# EAGLE design ch340-breakout (EAGLE 6.1)
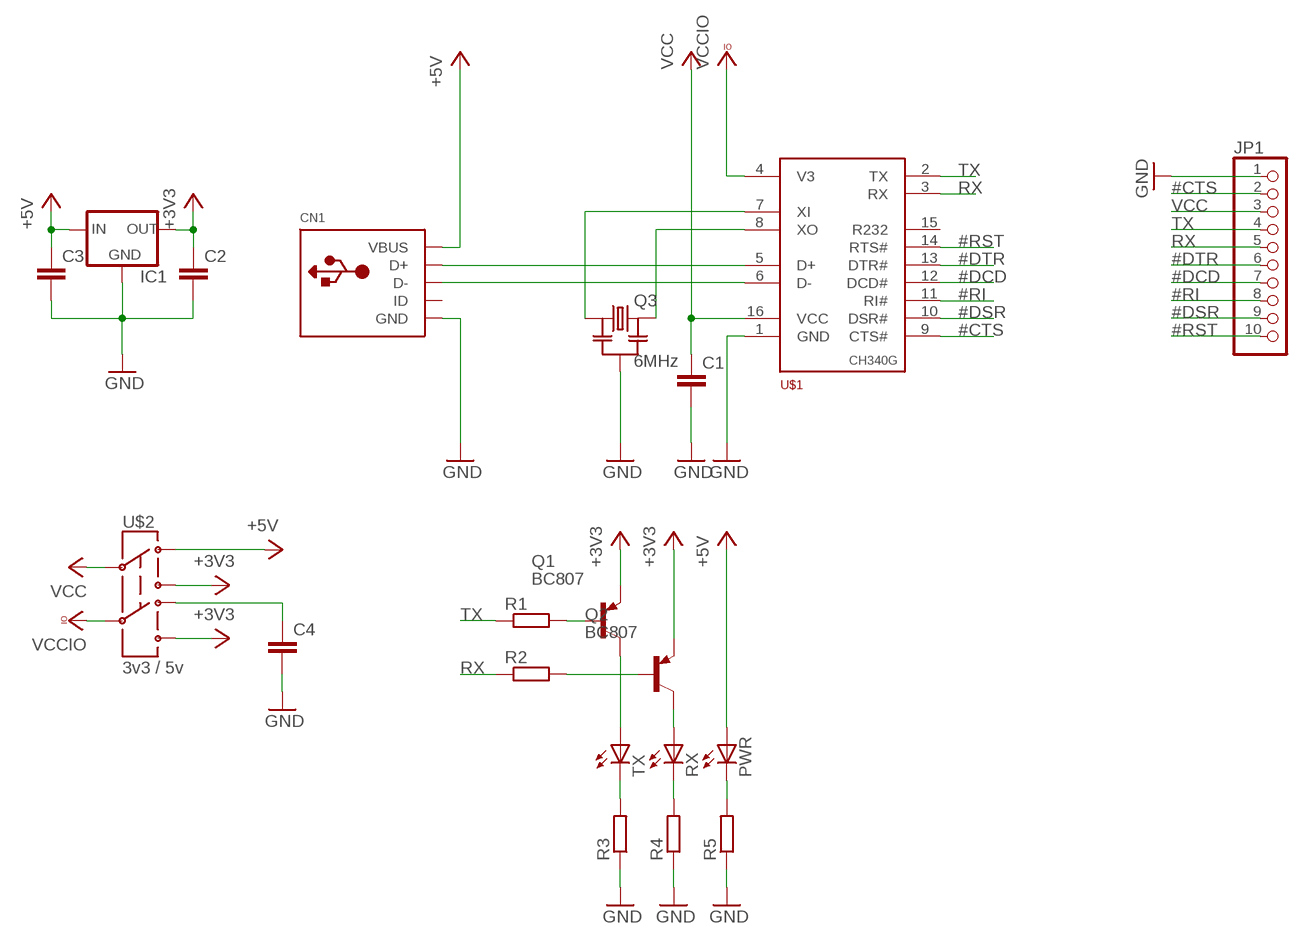
[diagram p0: schematic, sheet 1]

## Parts
C1  C-EUC0805  [C0805]
C2  C-EUC0805  [C0805]
C3  C-EUC0805  [C0805]
C4  C-EUC0805  [C0805]
CN1  USBTHM  [USB-MINIB-THM]
IC1  MCP1700_SOT-32  [SOT23]
JP1  PINHD-1X10  [1X10]
PWR  LEDSML0805  [SML0805]
Q1  BC807  BC807-40SMD  [SOT23-BEC]
Q2  BC807  BC807-40SMD  [SOT23-BEC]
Q3  6MHz  RESONATOR-MURATACSTCR_G  [RESONATOR_MURATA3]
R1  R-EU_R0805  [R0805]
R2  R-EU_R0805  [R0805]
R3  R-EU_R0805  [R0805]
R4  R-EU_R0805  [R0805]
R5  R-EU_R0805  [R0805]
RX  LEDSML0805  [SML0805]
TX  LEDSML0805  [SML0805]
U$1  CH340G  [SO16]
U$2  3v3 / 5v  AYZ0202  [AYZ0202]

## Nets
#CTS: JP1.2 U$1.9(CTS#)
#DCD: JP1.7 U$1.12(DCD#)
#DSR: JP1.9 U$1.10(DSR#)
#DTR: JP1.6 U$1.13(DTR#)
#RI: JP1.8 U$1.11(RI#)
#RST: JP1.10 U$1.14(RTS#)
+3V3: C2.1 IC1.2(OUT) Q1.E Q2.E U$2.1 U$2.4
+5V: C3.1 CN1.VBUS IC1.3(IN) PWR.A U$2.3
GND: C1.2 C2.2 C3.2 C4.2 CN1.GND IC1.1(GND) JP1.1 Q3.2 R3.1 R4.1 R5.1 U$1.1(GND)
N$1: CN1.D+ U$1.5(D+)
N$2: CN1.D- U$1.6(D-)
N$3: Q3.1 U$1.7(XI)
N$4: Q3.3 U$1.8(XO)
N$5: C4.1 U$2.6
N$6: PWR.C R5.2
N$8: R3.2 TX.C
N$9: R4.2 RX.C
N$10: Q2.C RX.A
N$11: Q1.C TX.A
N$12: Q2.B R2.2
N$13: Q1.B R1.2
RX: JP1.5 R2.1 U$1.3(RX)
TX: JP1.4 R1.1 U$1.2(TX)
VCC: C1.1 JP1.3 U$1.16(VCC) U$2.2
VCCIO: U$1.4(V3) U$2.5
Unconnected: CN1.ID U$1.15(R232)

## Library data of the parts
C1-C4 = rcl:C-EU: CAPACITOR, European symbol
CN1 = adafruit:USB: USB Connectors USBMINIB - Surface Mount Female Mini-B USB Connector 4UConnector: 06564 By microbuilder.eu Thru-hole RA Female Mini-B USB Connector 4UConnector: 18732 By ladyada.net
IC1 = _MY_OWN_LIB:MCP1700: VOLTAGE REGULATOR
JP1 = pinhead:PINHD-1X10: PIN HEADER
PWR RX TX = led:LED: LED OSRAM: - CHIPLED LG R971, LG N971, LY N971, LG Q971, LY Q971, LO R971, LY R971 LH N974, LH R974 LS Q976, LO Q976, LY Q976 LO Q996 - Hyper CHIPLED LW Q18S LB Q993, LB Q99A, LB R99A - SideLED LS A670, LO A670, LY A670, LG A670, LP A670 LB A673, LV A673, LT A673, LW A673 LH A674 LY A675 LS A676, LA A676, LO A676, LY A676, LW A676 LS A679, LY A679, LG A679 - Hyper Micro SIDELED® LS Y876, LA Y876, LO Y876, LY Y876 LT Y87S - SmartLED LW L88C, LW L88S LB L89C, LB L89S, LG L890 LS L89K, LO L89K, LY L89K LS L896, LA L896, LO L896, LY L896 - TOPLED LS T670, LO T670, LY T670, LG T670, LP T670 LSG T670, LSP T670, LSY T670, LOP T670, LYG T670 LG T671, LOG T671, LSG T671 LB T673, LV T673, LT T673, LW T673 LH T674 LS T676, LA T676, LO T676, LY T676, LB T676, LH T676, LSB T676, LW T676 LB T67C, LV T67C, LT T67C, LS T67K, LO T67K, LY T67K, LW E67C LS E67B, LA E67B, LO E67B, LY E67B, LB E67C, LV E67C, LT E67C LW T67C LS T679, LY T679, LG T679 LS T770, LO T770, LY T770, LG T770, LP T770 LB T773, LV T773, LT T773, LW T773 LH T774 LS E675, LA E675, LY E675, LS T675 LS T776, LA T776, LO T776, LY T776, LB T776 LHGB T686 LT T68C, LB T68C - Hyper Mini TOPLED® LB M676 - Mini TOPLED Santana® LG M470 LS M47K, LO M47K, LY M47K Source: http://www.osram.convergy.de LUXEON: - LUMILED® LXK2-PW12-R00, LXK2-PW12-S00, LXK2-PW14-U00, LXK2-PW14-V00 LXK2-PM12-R00, LXK2-PM12-S00, LXK2-PM14-U00 LXK2-PE12-Q00, LXK2-PE12-R00, LXK2-PE12-S00, LXK2-PE14-T00, LXK2-PE14-U00 LXK2-PB12-K00, LXK2-PB12-L00, LXK2-PB12-M00, LXK2-PB14-N00, LXK2-PB14-P00, LXK2-PB14-Q00 LXK2-PR12-L00, LXK2-PR12-M00, LXK2-PR14-Q00, LXK2-PR14-R00 LXK2-PD12-Q00, LXK2-PD12-R00, LXK2-PD12-S00 LXK2-PH12-R00, LXK2-PH12-S00 LXK2-PL12-P00, LXK2-PL12-Q00, LXK2-PL12-R00 Source: www.luxeon.com KINGBRIGHT: KA-3528ASYC Source: www.kingbright.com
Q1 Q2 = transistor-pnp:BC807*: PNP Transistror
Q3 = m-pad-2.1:RESONATOR-MURATA: Murata ceramic Resonator "ceralock" CSTCE series with built in load capacitance +- 0.5% tolerance 12.51MHz to 19.99MHz 16MHz murata part#: CSTCE16M0V53-R0 16MHz digikey part#: 490-1198-1-ND $1.33 each
R1-R5 = rcl:R-EU_: RESISTOR, European symbol
U$1 = _MY_OWN_LIB:CH340G
U$2 = SparkFun-Electromechanical:AYZ0202: SPDT Slide Switch Simple SMD single-pull double-throw slide switch. Good for less than 350mA power switch, switching UARTs between devices, etc. Spark Fun Electronics SKU : COM-00597

## Board
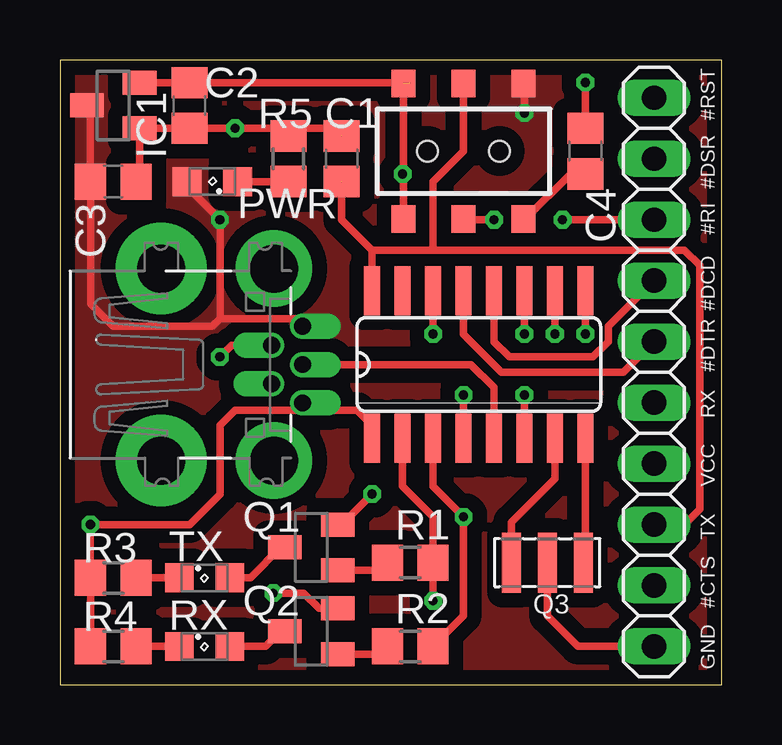
[diagram p1: board, top side]
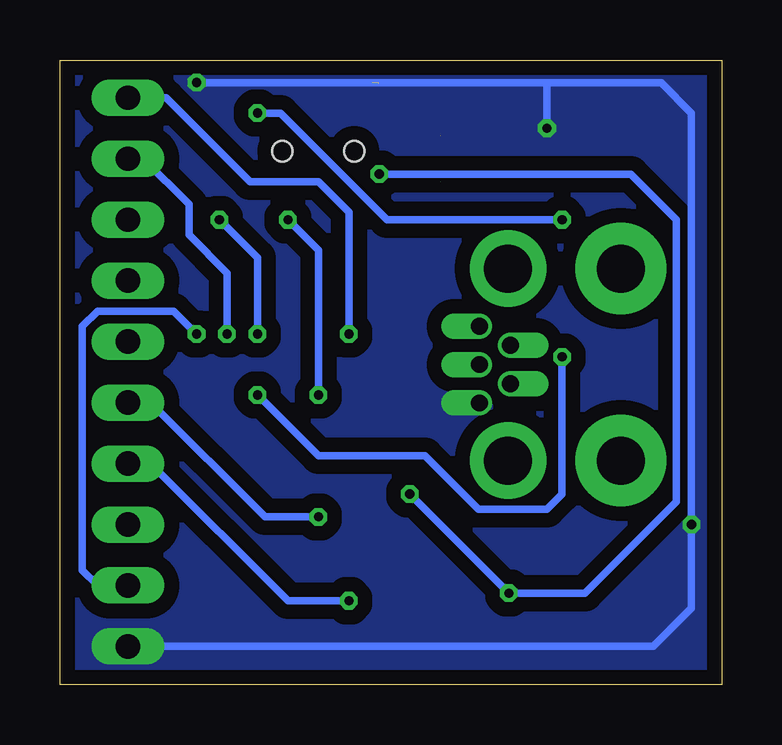
[diagram p2: board, bottom side, seen from below]

Size 27.6 x 26.02 mm. Coordinates in mm from the lower left corner, seen from the top.
Outline: 0,0 27.6,0 27.6,26.02 0,26.02 0,0
Copper layers (1*16): Top 0.0356mm / dielectric 1.5011mm / Bottom 0.0356mm
Design rules: minimum track width 6mil, minimum drill 13mil, track to track 6mil, track to pad 6mil, pad to pad 6mil, via to via 6mil, smd to smd 6mil, copper to edge 15mil, drill to drill 6mil, minimum pad ring 7mil, minimum via ring 7mil, stop-mask expansion 3mil, vias tented up to drill 0mil, thermal gap 10mil

### Footprints (pad centres in the part's own frame; a part is rotated, then mirrored left to right if it is on the bottom)
C0805 = smd 1.3 x 1.5: 1 -0.95,0; 2 0.95,0
USB-MINIB-THM = drill 0.7 offset: D+ 0,9.8; D- -0.8,8.5; GND 1.6,9.8; ID 0.8,8.5; VBUS -1.6,9.8 | drill 2 pad 3.81: GND1 -4,3.9; GND4 4,3.9 | drill 2 pad 3.2: GND2 -4,8.6; GND3 4,8.6
SOT23 = smd 1 x 1.4: 1 -0.95,-1.1; 2 0.95,-1.1; 3 0,1.1
1X10 = drill 1.016 long: 1 -11.43,0; 2 -8.89,0; 3 -6.35,0; 4 -3.81,0; 5 -1.27,0; 6 1.27,0; 7 3.81,0; 8 6.35,0; 9 8.89,0; 10 11.43,0
SML0805 = smd 1.2 x 1.2: A 1.05,0; C -1.05,0
SOT23-BEC = smd 1 x 1.4: B -0.95,-1.1; C 0,1.1; E 0.95,-1.1
RESONATOR_MURATA3 = smd 0.8 x 2.5: 1 -1.5,0; 2 0,0; 3 1.5,0
R0805 = smd 1.3 x 1.5: 1 -0.95,0; 2 0.95,0
SO16 = smd 2.032 x 0.66: 1 -0.533,6.985; 2 -0.533,5.715; 3 -0.533,4.445; 4 -0.533,3.175; 5 -0.533,1.905; 6 -0.533,0.635; 7 -0.533,-0.635; 8 -0.533,-1.905; 9 5.613,-1.905; 10 5.613,-0.635; 11 5.613,0.635; 12 5.613,1.905; 13 5.613,3.175; 14 5.613,4.445; 15 5.613,5.715; 16 5.613,6.985
AYZ0202 = smd 1 x 1.15: 1 -2.5,2.825; 2 0,2.825; 3 2.5,2.825; 4 -2.5,-2.825; 5 0,-2.825; 6 2.5,-2.825 | hole 0.85: 1.5,0; -1.5,0

### Placement (x,y rotation side)
C1  11.75,21.91 90 top
C2  5.4,24.13 270 top
C3  2.22,20.95 0 top
C4  21.91,22.23 90 top
CN1  0.32,13.34 270 top
IC1  2.22,24.13 90 top
JP1  24.77,13.02 90 top
PWR  6.35,20.95 180 top
Q1  10.48,5.71 90 top
Q2  10.48,2.22 90 top
Q3  20.32,5.08 0 top
R1  14.61,5.08 180 top
R2  14.61,1.59 180 top
R3  2.22,4.45 0 top
R4  2.22,1.59 0 top
R5  9.53,21.91 270 top
RX  6.03,1.59 0 top
TX  6.03,4.45 0 top
U$1  20,10.79 90 top
U$2  16.83,22.23 0 top

### Tracks (layer width: path | path; a pad name or v marks a point on that pad's centre or on a via)
#CTS  (via drill 0.38)
  Top 0.305: U$1.9 v21.91,14.61
  Bottom 0.305: v21.91,14.61 22.86,15.56 26.04,15.56 26.67,14.92 26.67,4.76 26.04,4.13 JP1.2
#DCD
  Top 0.305: U$1.12 18.1,14.29 18.73,13.65 22.23,13.65 22.86,14.29 22.86,14.92 JP1.7
#DSR  (via drill 0.38)
  Top 0.305: U$1.10 v20.64,14.61
  Bottom 0.305: v20.64,14.61 20.64,17.14 22.23,18.73 22.23,20 24.13,21.91 JP1.9
#DTR
  Top 0.305: U$1.13 16.83,14.61 18.41,13.02 23.5,13.02 JP1.6
#RI  (via drill 0.38)
  Top 0.305: U$1.11 v19.37,14.61 | v20.95,19.37 JP1.8
  Bottom 0.305: v19.37,14.61 19.37,17.78 v20.95,19.37
#RST  (via drill 0.38)
  Top 0.305: U$1.14 v15.56,14.61
  Bottom 0.305: v15.56,14.61 15.56,19.68 16.83,20.95 19.68,20.95 23.18,24.45 JP1.10
+3V3  (via drill 0.38)  (1 unrouted)
  Top 0.305: IC1.2 C2.1 14.6,25.08 14.61,25.08 | U$2.1 14.33,21.23 | 14.33,21.23 U$2.4 | U$2.4 14.29,19.37 | 11.43,6.67 Q1.E 11.75,6.67 v13.02,7.94 | U$2.4 | 14.33,21.23 v14.29,21.27 | Q2.E 10.8,3.17 10.16,3.81 v8.89,3.81
  Bottom 0.305: v14.29,21.27 3.81,21.27 1.91,19.37 1.91,7.62 5.71,3.81 v8.89,3.81 v13.02,7.94
+5V  (via drill 0.38)
  Top 0.305: 6.67,15.24 6.35,14.92 2.22,14.92 1.27,15.87 C3.1 1.27,23.81 0.95,24.13 | 6.67,15.24 9.81,15.24 CN1.VBUS 10.15,14.94 10.16,14.92 | PWR.A 5.3,20.73 v6.67,19.37 6.67,15.24 | v19.37,23.81 19.37,25.01 U$2.3
  Bottom 0.305: v19.37,23.81 18.41,23.81 13.97,19.37 v6.67,19.37
  pour Top (isolate 0.61, no thermals): 0,0 27.62,0 27.62,26.04 0,26.04
GND  (via drill 0.38)  (1 unrouted)
  Top 0.305: C3.2 3.32,21.11 IC1.1 C2.2 | C2.2 v7.3,23.18 | v7.3,23.18 9.2,23.18 R5.1 9.53,23.18 | 9.53,23.18 C2.2 | CN1.GND 10.12,11.71 9.84,11.43 | 9.84,11.43 7.3,11.43 6.67,10.79 6.67,7.94 5.4,6.67 v1.27,6.67 R3.1 R4.1 | v7.3,23.18 | 9.53,23.18 11.43,23.18 C1.2 | C4.2 v21.91,25.08 | 9.84,11.43 12.38,11.43 13.02,10.79 U$1.1 | Q3.2 20.32,2.86 21.59,1.59 JP1.1
  Bottom 0.305: v21.91,25.08 7.3,25.08 | 7.3,25.08 v7.3,23.18 | 7.3,25.08 2.54,25.08 1.27,23.81 v1.27,6.67 1.27,3.17 2.86,1.59 JP1.1
  pour Bottom (isolate 0.61, no thermals): 0,0 27.62,0 27.62,26.04 0,26.04
N$1
  Top 0.305: CN1.D+ 17.14,13.34 18.1,12.38 U$1.5 18.1,10.16
N$2  (via drill 0.38)
  Top 0.305: v19.37,12.06 U$1.6 19.37,10.16 | CN1.D- 7.15,14.13 v6.67,13.65
  Bottom 0.305: v6.67,13.65 6.67,7.94 7.3,7.3 10.16,7.3 12.38,9.53 16.83,9.53 v19.37,12.06
N$3
  Top 0.305: Q3.1 18.82,6.75 20.64,8.57 U$1.7
N$4
  Top 0.305: Q3.3 21.82,6.12 21.91,6.03 U$1.8
N$5
  Top 0.305: U$2.6 19.4,19.4 21.27,21.27 C4.1
N$6
  Top 0.305: PWR.C R5.2
N$8
  Top 0.305: R3.2 TX.C
N$9
  Top 0.305: RX.C R4.2
N$10
  Top 0.305: Q2.C 9.21,2.22 8.57,1.59 RX.A
N$11
  Top 0.305: Q1.C 9.21,5.71 7.94,4.45 TX.A
N$12
  Top 0.305: Q2.B 13.34,1.27 R2.2
N$13
  Top 0.305: Q1.B 13.34,4.76 R1.2
RX  (via drill 0.38)
  Top 0.305: U$1.3 15.56,8.26 v16.83,6.99 16.83,2.86 R2.1
  Bottom 0.305: v16.83,6.99 19.05,6.99 23.81,11.75 JP1.5
TX  (via drill 0.38)
  Top 0.305: U$1.2 14.29,8.26 15.56,6.99 R1.1 v15.55,3.5 v15.56,3.49
  Bottom 0.305: v15.56,3.49 18.1,3.49 23.81,9.21 JP1.4
VCC  (1 unrouted)
  Top 0.305: U$1.16 13.02,18.1 | 13.02,18.1 11.75,19.37 C1.1 | U$2.2 16.83,22.23 15.56,20.95 15.56,18.1 | 13.02,18.1 15.56,18.1 | 15.56,18.1 26.04,18.1 26.67,17.46 26.67,7.3 26.04,6.67 JP1.3
VCCIO  (via drill 0.38)
  Top 0.305: U$2.5 16.83,19.37 v18.1,19.37 | v16.83,12.06 U$1.4
  Bottom 0.305: v18.1,19.37 16.83,18.1 v16.83,12.06

### Text on the board
tNames: #RST | #DSR | #RI | #DCD | #DTR | RX | VCC | TX | #CTS | GND